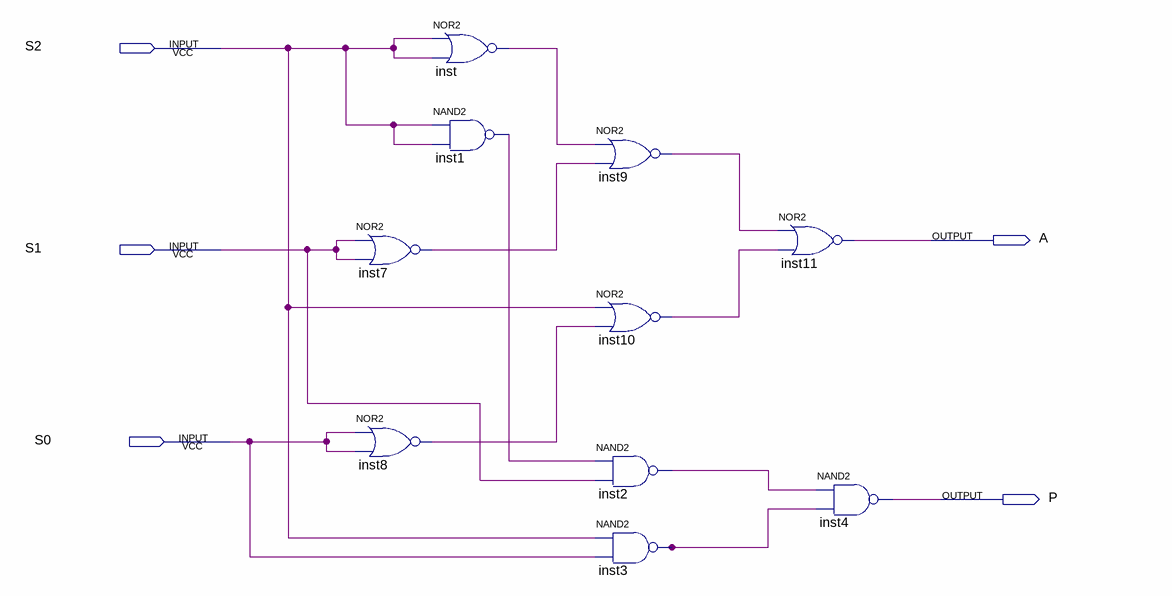
[diagram p0: schematic sheet]
// Quartus schematic lab5.bdf as structural Verilog: 10 symbols, 5 pins
module lab5 (
  input  S2,
  input  S1,
  input  S0,
  output A,
  output P
);

  wire inst1_out, inst2_out, inst3_out, inst7_out, inst8_out, inst9_out, inst10_out, inst_out;

  nor inst7 (inst7_out, S1, S1);
  nor inst8 (inst8_out, S0, S0);
  nor inst (inst_out, S2, S2);
  nand inst1 (inst1_out, S2, S2);
  nor inst9 (inst9_out, inst_out, inst7_out);
  nor inst10 (inst10_out, S2, inst8_out);
  nand inst2 (inst2_out, inst1_out, S1);
  nand inst3 (inst3_out, S2, S0);
  nor inst11 (A, inst9_out, inst10_out);
  nand inst4 (P, inst2_out, inst3_out);
endmodule
